# Altium schematic sheet SD.SchDoc
size A4; SheetNumber: 6; SheetTotal: 7
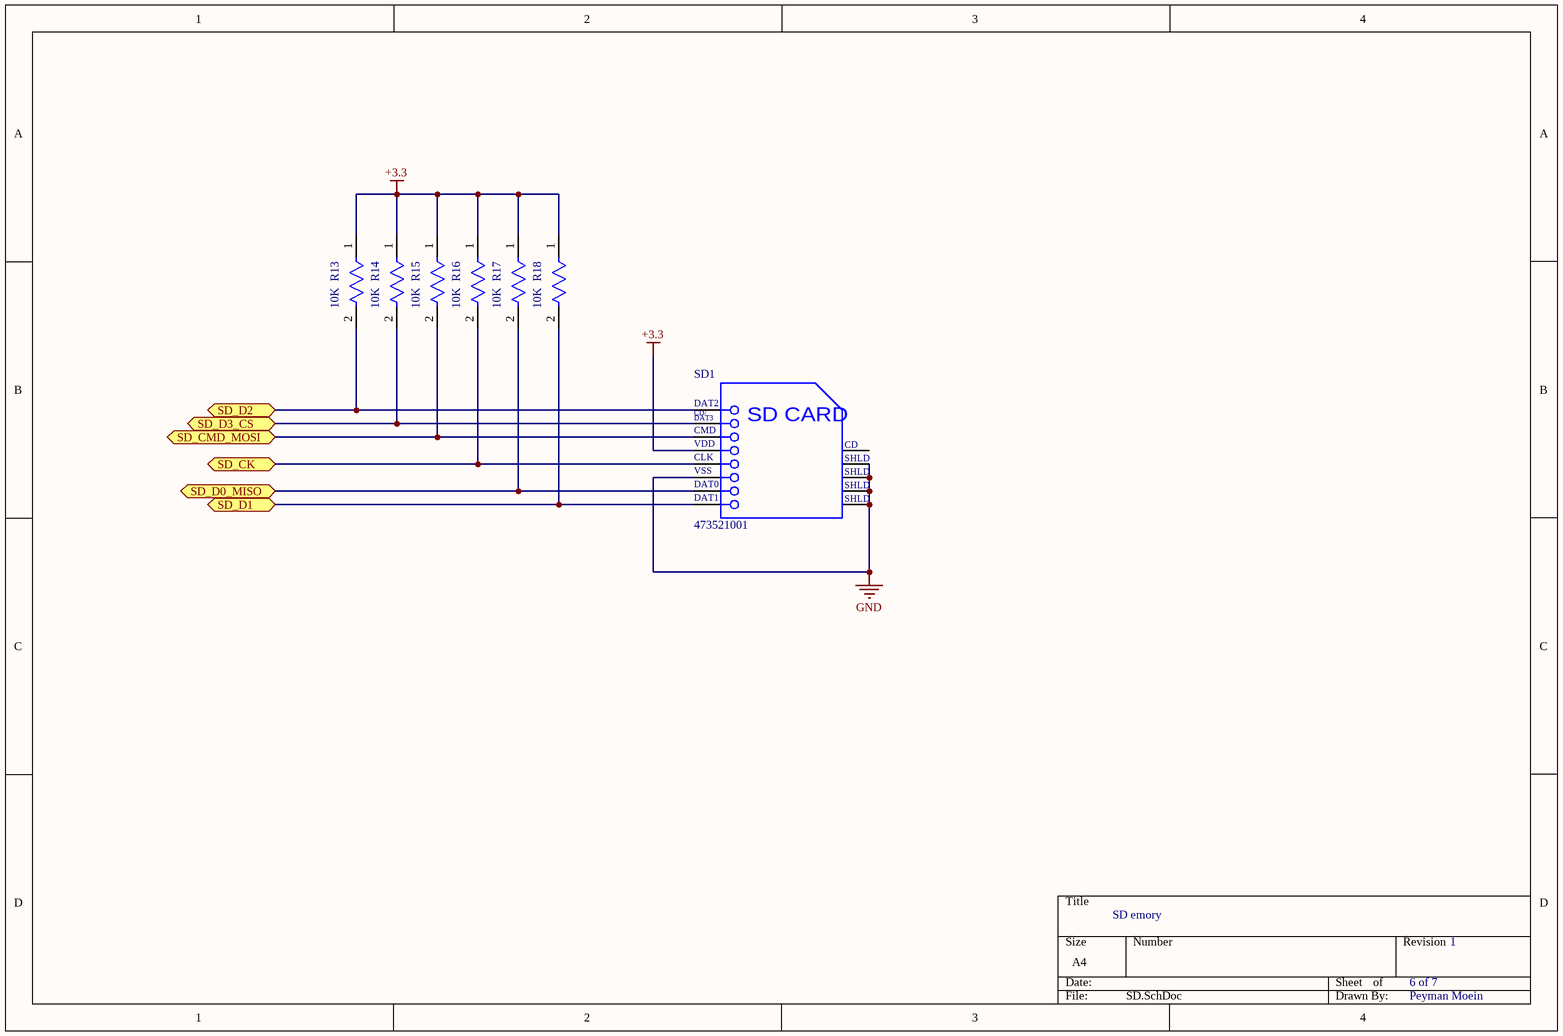
[diagram p0: SD.SchDoc]

## Parts
R13  10K  [FP-CRCW0805-e3-MFG]
R14  10K  [FP-CRCW0805-e3-MFG]
R15  10K  [FP-CRCW0805-e3-MFG]
R16  10K  [FP-CRCW0805-e3-MFG]
R17  10K  [FP-CRCW0805-e3-MFG]
R18  10K  [FP-CRCW0805-e3-MFG]
SD1  473521001  [MOLX-473521001_V]

## Ports
SD_CK (bidir), SD_CMD_MOSI (bidir), SD_D0_MISO (bidir), SD_D1 (bidir), SD_D2 (bidir), SD_D3_CS (bidir)

## Nets
+3.3: R13.1 R14.1 R15.1 R16.1 R17.1 R18.1 SD1.4(VDD)
GND: SD1.6(VSS) SD1.10(SHLD) SD1.11(SHLD) SD1.12(SHLD) SD1.13(SHLD)
SD_CK: R16.2 SD1.5(CLK) ; port SD_CK
SD_CMD_MOSI: R15.2 SD1.3(CMD) ; port SD_CMD_MOSI
SD_D0_MISO: R17.2 SD1.7(DAT0) ; port SD_D0_MISO
SD_D1: R18.2 SD1.8(DAT1) ; port SD_D1
SD_D2: R13.2 SD1.1(DAT2) ; port SD_D2
SD_D3_CS: R14.2 SD1.2(CD/DAT3) ; port SD_D3_CS

Not connected (* = marked no-connect by the designer): SD1 9(CD)

## Notes on the sheet
- SD emory
- 6 of 7
- 1
- Peyman Moein
- (in symbol CMP-2000-05848-1) CD/; DAT3; SD CARD

## Library data of the parts
R13-R18 = CMP-02407-004193-1: C478887; Tolerance: 1%; Resistance: 2.94R; Max Power Dissipation: 125mW; Temperature Coefficient: 100ppm/°C; Voltage Rating: 150V; Case/Package: 0805; Radiation Hardening: No; Width: 0.049inch; Packaging: Tape and Reel; Height: 0.02inch; Case Code (Imperial): 0805; Length: 2mm; Termination: SMD/SMT; Lead Free: Lead Free; Weight: 0.000194oz; Features: Automotive AEC-Q200; Min Operating Temperature: -55°C; Case Code (Metric): 2012; Contact Plating: Tin; Composition: Thick Film; Military Standard: Not; Number of Terminations: 2; Depth: 1.25mm; Package Quantity: 10; Max Operating Temperature: 155°C; Power Rating: 125mW
SD1 = CMP-2000-05848-1: C293569; Manufacturer: Molex; Datasheet Version: Rev. G, 01/2012; Datasheet URL: http://www.molex.com/pdm_docs/sd/473521001_sd.pdf; Package Reference: 473521001; Manufacturer URL: http://www.molex.com/; Mounting Technology: SurfaceMount; Package Description: MicroSD(TM), Pitch 1.1 mm, 8 Position, Height 1.88 mm